# EAGLE design joystick-tester-smd (EAGLE 9.4.0)
Tester for 9-pin Atari and Commodore compatible joysticks
REV: 2
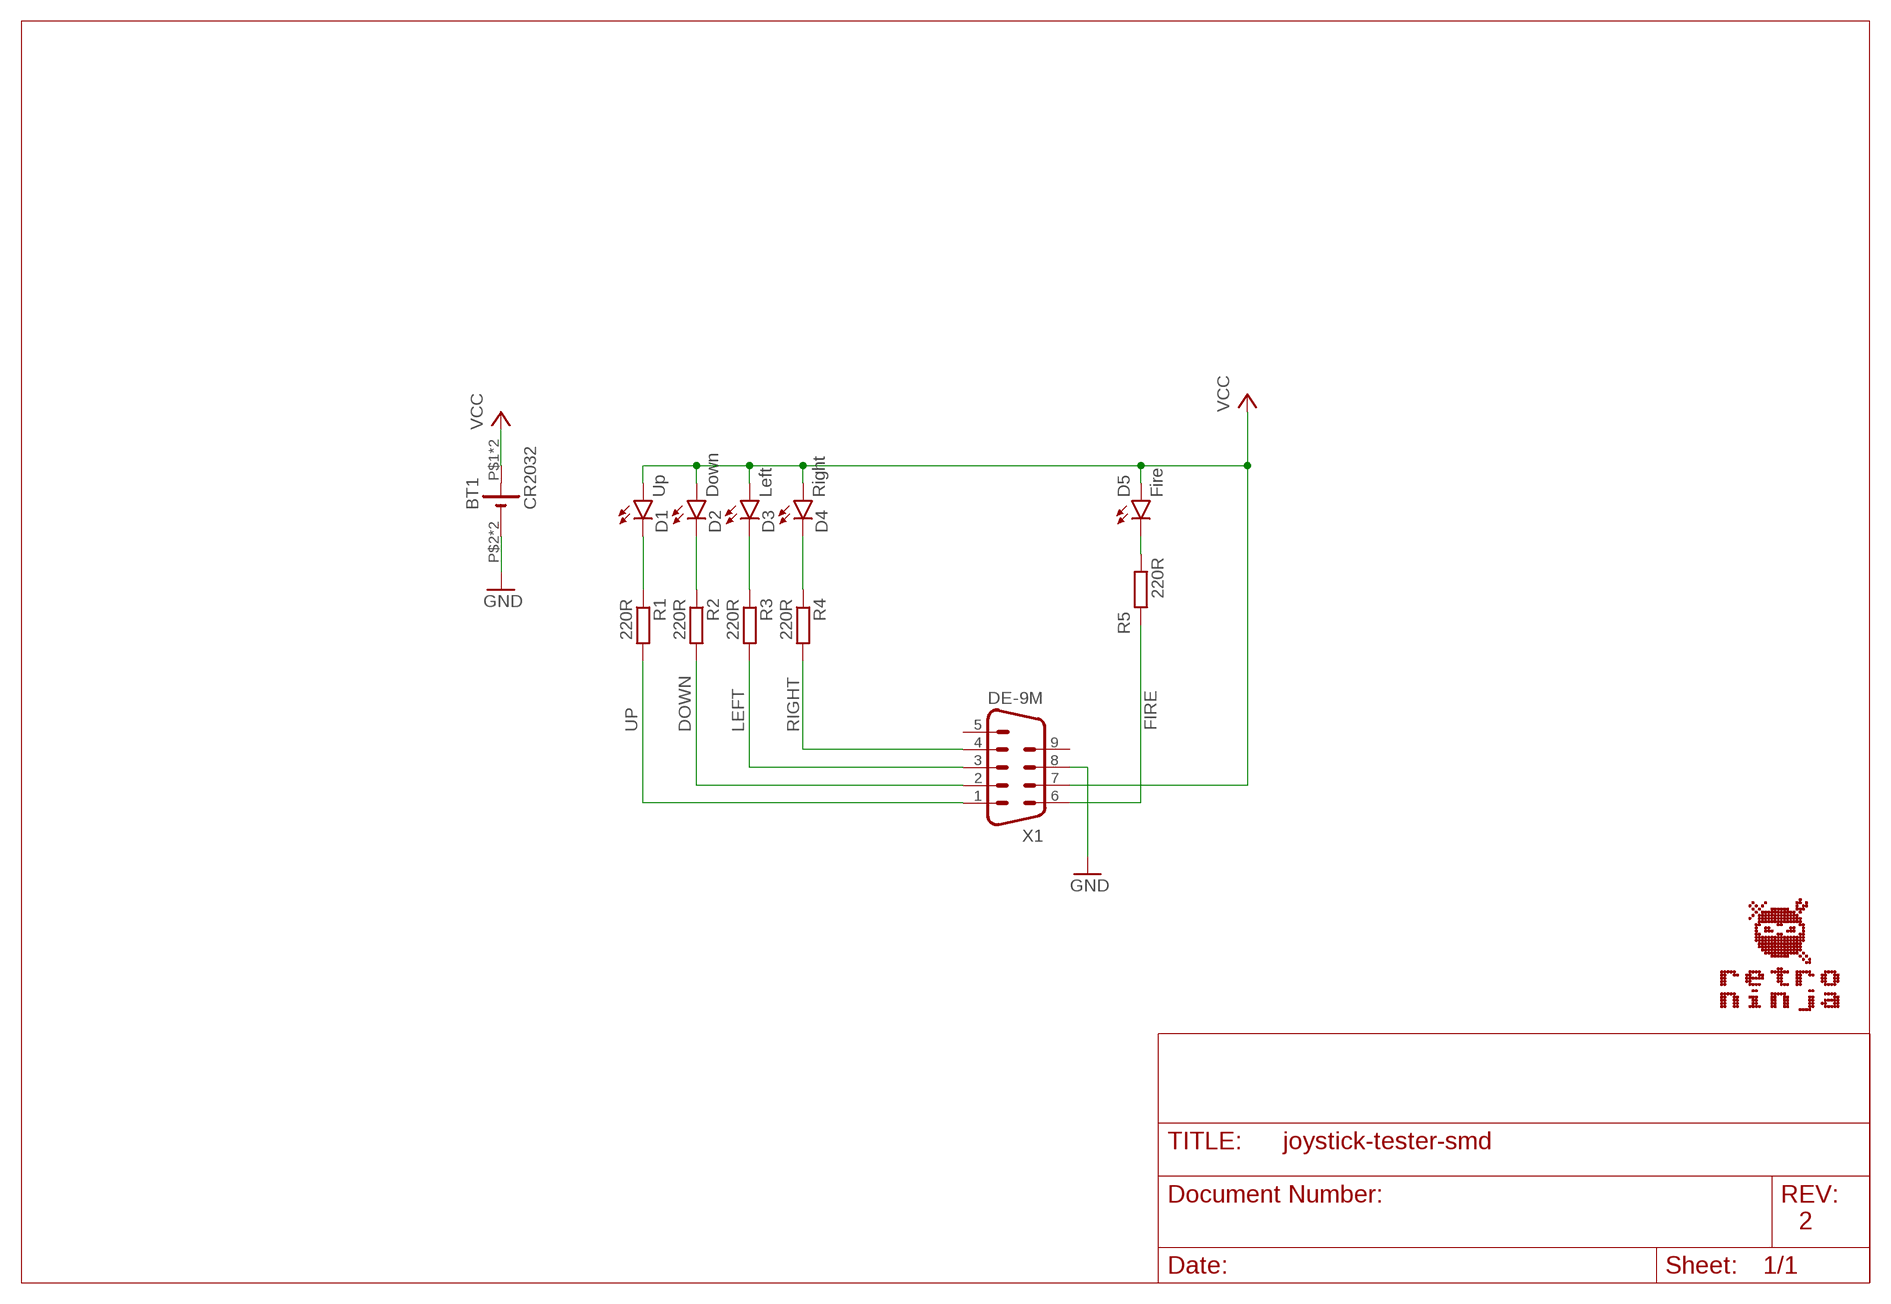
[diagram p0: schematic, sheet 1]

## Parts
BT1  CR2032  CR2032-COMBO-20MM-30MM_SMD  [CR2032_2P30SMD_20MM_COMBO]
D1  Up  LED1206  [LED-1206]
D2  Down  LED1206  [LED-1206]
D3  Left  LED1206  [LED-1206]
D4  Right  LED1206  [LED-1206]
D5  Fire  LED1206  [LED-1206]
R1  220R  R-EU_M0805  [M0805]
R2  220R  R-EU_M0805  [M0805]
R3  220R  R-EU_M0805  [M0805]
R4  220R  R-EU_M0805  [M0805]
R5  220R  R-EU_M0805  [M0805]
X1  DE-9M  M09D  [M09D]

## Nets
DOWN: R2.2 X1.2
FIRE: R5.1 X1.6
GND: BT1.P$2(-) BT1.P$4(-) X1.8
LEFT: R3.2 X1.3
N$1: D4.C R4.1
N$3: D5.C R5.2
N$5: D1.C R1.1
N$6: D2.C R2.1
N$7: D3.C R3.1
RIGHT: R4.2 X1.4
UP: R1.2 X1.1
VCC: BT1.P$1(+) BT1.P$3(+) D1.A D2.A D3.A D4.A D5.A X1.7
Unconnected: X1.5 X1.9

## Notes on the sheet
- 2

## Library data of the parts
BT1 = Per:CR2032
D1-D5 = SparkFun-LED:LED: LEDs Standard schematic elements and footprints for 5mm, 3mm, 1206, and 0603 sized LEDs. 5mm - Spark Fun Electronics SKU : COM-00529 (and others)
R1-R5 = rcl:R-EU_: RESISTOR, European symbol; SPICEPREFIX: R
X1 = con-subd:M09: SUB-D; OC_FARNELL: unknown; OC_NEWARK: unknown

## Board
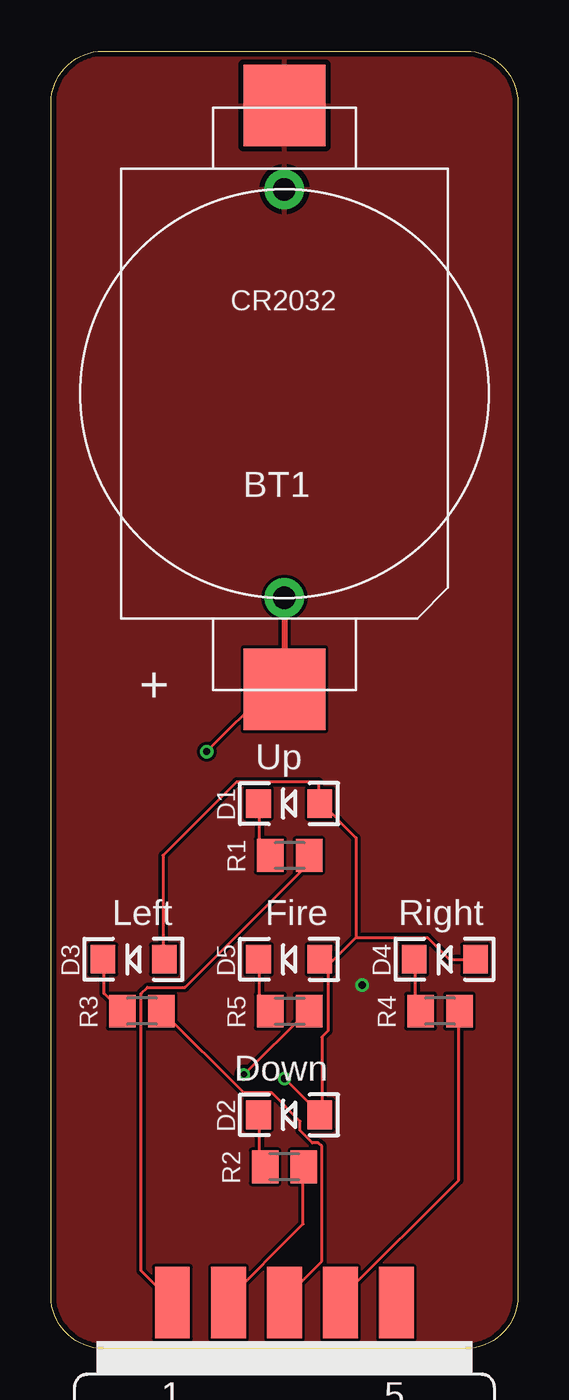
[diagram p1: board, top side]
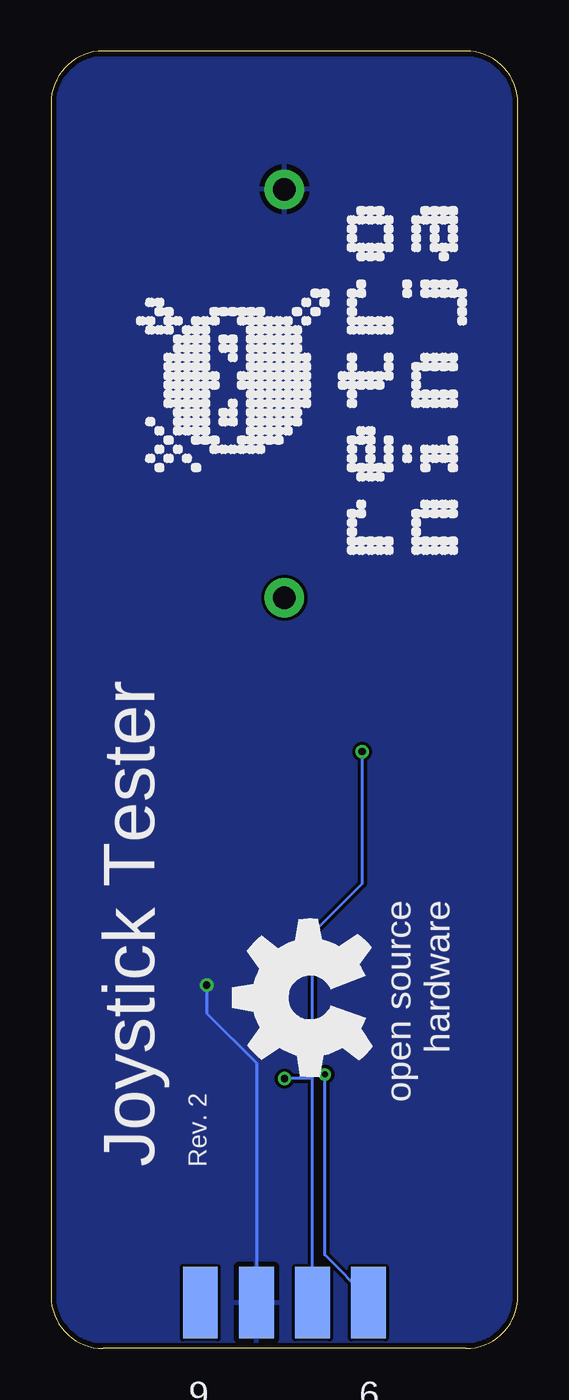
[diagram p2: board, bottom side, seen from below]

Size 22.86 x 63.5 mm. Coordinates in mm from the lower left corner, seen from the top.
Outline: 0,60.96 arc-90 2.54,63.5 20.32,63.5 arc-90 22.86,60.96 22.86,2.54 arc-90 20.32,0 2.54,0 arc-90 0,2.54 0,60.96
Copper layers (1*16): Top 0.035mm / dielectric 1.5mm / Bottom 0.035mm
Design rules "SeeedStudio_2layer_DRU_no_angle_20140221": minimum track width 6mil, minimum drill 12mil, track to track 6mil, track to pad 6mil, pad to pad 6mil, via to via 6mil, smd to smd 0mil, copper to edge 10mil, drill to drill 10mil, minimum pad ring 10mil, minimum via ring 6mil, stop-mask expansion 2mil, vias tented up to drill 100mil, thermal gap 10mil

### Footprints (pad centres in the part's own frame; a part is rotated, then mirrored left to right if it is on the bottom)
CR2032_2P30SMD_20MM_COMBO = smd 4 x 4: P$1 0,14.478; P$2 0,-14.097 | drill 1.1 pad 1.93: P$3 0,10; P$4 0,-10
LED-1206 = smd 1.2 x 1.4: A -1.5,0; C 1.5,0
M0805 = smd 1.3 x 1.6: 1 -0.95,0; 2 0.95,0
M09D = smd 1.7 x 3.5: 1 5.486,-6.045; 2 2.743,-6.045; 3 0,-6.045; 4 -2.743,-6.045; 5 -5.486,-6.045 | smd 1.7 x 3.5 bottom: 6 4.115,-6.045; 7 1.372,-6.045; 8 -1.372,-6.045; 9 -4.115,-6.045

### Placement (x,y rotation side)
BT1  11.43,46.74 180 top
D1  11.66,26.67 180 top
D2  11.66,11.43 180 top
D3  4.04,19.05 180 top
D4  19.28,19.05 180 top
D5  11.66,19.05 180 top
R1  11.68,24.13 0 top
R2  11.43,8.89 0 top
R3  4.45,16.51 0 top
R4  19.05,16.51 0 top
R5  11.68,16.51 180 top
U$2  [OSHW_8MM]  10.16,17.14 90 bottom
X1  11.43,-3.81 180 top

### Tracks (layer width: path | path; a pad name or v marks a point on that pad's centre or on a via)
DOWN
  Top 0.152: R2.2 12.34,8.84 12.34,6.1 8.53,2.29 X1.2
FIRE  (via drill 0.3)
  Top 0.152: v9.45,13.41 12.5,16.46 R5.1
  Bottom 0.152: v9.45,13.41 9.45,4.57 7.32,2.44 X1.6
GND  (via drill 0.35)
  Bottom 0.152: v15.24,17.78 15.24,16.41 12.8,13.97 X1.8
  pour Top (rank 3): -1.27,-1.27 -1.27,64.77 24.13,64.77 24.13,-1.27
  pour Bottom (rank 3): -1.27,-1.27 -1.27,64.77 24.13,64.77 24.13,-1.27
LEFT
  Top 0.152: X1.3 11.43,2.44 13.26,4.27 13.26,9.91 13.11,10.06 12.8,10.06 12.19,10.67 12.19,11.12 10.82,12.5 9.45,12.5 5.49,16.46 R3.2
N$1
  Top 0.152: D4.C 17.83,19.05 17.83,16.76 17.98,16.61 R4.1
N$3
  Top 0.152: D5.C 10.21,19.05 10.21,17.07 10.67,16.61 R5.2
N$5
  Top 0.152: D1.C 10.21,26.67 10.21,24.69 10.67,24.23 R1.1
N$6
  Top 0.152: D2.C 10.21,11.43 10.21,9.14 10.36,8.99 R2.1
N$7
  Top 0.152: D3.C 2.59,19.05 2.59,17.37 3.35,16.61 R3.1
RIGHT
  Top 0.152: R4.2 19.96,16.46 19.96,8.23 14.33,2.59 14.33,2.29 X1.4
UP
  Top 0.152: R1.2 12.5,24.08 12.5,23.62 6.55,17.68 4.72,17.68 4.42,17.37 4.42,3.81 5.94,2.29 X1.1
VCC  (via drill 0.35)
  Top 0.152: 13.56,18.75 13.56,15.54 13.26,15.24 13.26,11.43 D2.A 13.16,11.48 v11.43,13.21 | 13.56,18.75 13.26,19.05 D5.A 13.56,18.75 | D4.A 19.51,19.05 18.44,20.12 14.94,20.12 | 13.56,18.75 14.94,20.12 | D3.A 5.49,19.05 5.49,24.13 9.09,27.74 13.11,27.74 13.11,26.67 D1.A 13.26,26.67 14.94,24.99 14.94,20.12 | v7.62,29.21 10.67,32.26 BT1.P$1
  Top 0.305: BT1.P$3 BT1.P$1
  Bottom 0.152: X1.7 10.06,13.21 | 10.06,13.21 10.06,20.32 7.62,22.76 v7.62,29.21 | 10.06,13.21 v11.43,13.21

### Text on the board
bPlace: Rev. 2 | Joystick Tester